# EAGLE schematic schematic_draft_v1 (EAGLE 9.6.2)
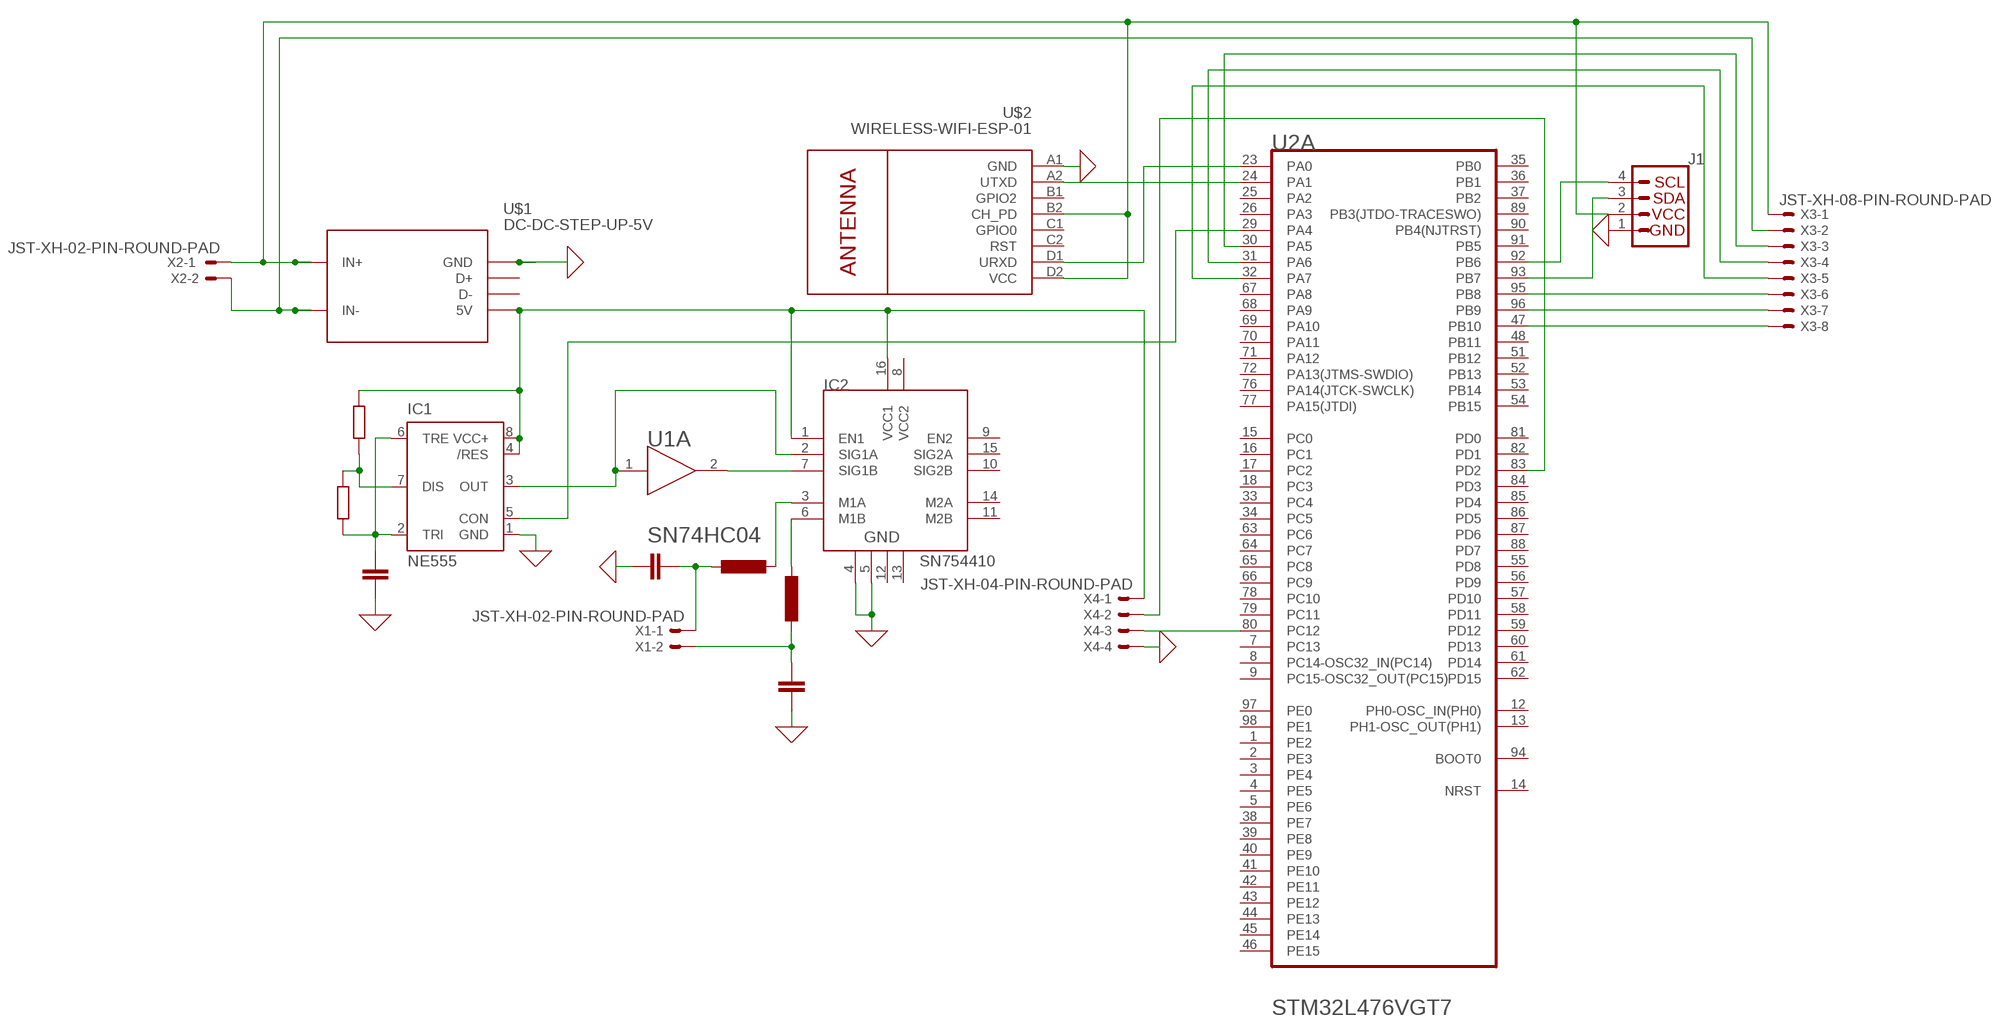
[diagram p0: schematic, sheet 1]

## Parts
IC1  NE555  [DIL-08]
IC2  SN754410  [DIP16]
J1  QWIIC_CONNECTORJS-1MM  [1X04_1MM_RA]
U1  TEXAS_INSTRUMENTS_SN74HC04TEXAS_INSTRUMENTS_SN74HC04_0_0  [TEXAS_INSTRUMENTS_SN74HC04_0]
U2  STMICROELECTRONICS_STM32L476VGT7STMICROELECTRONICS_STM32L476VGT7_0_0  [STMICROELECTRONICS_STM32L476VGT7_0]
U$1  DC-DC-STEP-UP-5V  [DC-DC-STEP-UP-5V]
U$2  WIRELESS-WIFI-ESP-01  [WIRELESS-WIFI-ESP-01]
X1  JST-XH-02-PIN-ROUND-PAD  [JST-XH-02-PACKAGE-ROUND-PAD]
X2  JST-XH-02-PIN-ROUND-PAD  [JST-XH-02-PACKAGE-ROUND-PAD]
X3  JST-XH-08-PIN-ROUND-PAD  [JST-XH-08-PACKAGE-ROUND-PAD]
X4  JST-XH-04-PIN-ROUND-PAD  [JST-XH-04-PACKAGE-ROUND-PAD]

## Nets
0: IC1.1(GND) IC2.4 IC2.5 J1.1(GND) U$1.GND U$2.A1(GND) X4.4 ; supply symbol labelled GND
N$1: U2.80(A:PC12) X4.3
N$2: J1.2(VCC) U$1.IN+ U$2.B2(CH_PD) U$2.D2(VCC) X2.1 X3.1
N$3: U$1.IN- X2.2 X3.2
N$4: IC1.2(TRI) IC1.6(TRE)
N$5: IC1.7(DIS)
N$6: J1.4(SCL) U2.92(A:PB6)
N$7: IC2.7(SIG1B) U1.2(A:!1Y!)
N$8: X1.1
N$9: X1.2
N$10: IC1.3(OUT) IC2.2(SIG1A) U1.1(A:1A)
N$11: U2.24(A:PA1) U$2.A2(UTXD)
N$12: IC2.3(M1A)
N$13: IC2.6(M1B)
N$14: U2.23(A:PA0) U$2.D1(URXD)
N$15: IC1.4(/RES) IC1.8(VCC+) IC2.1(EN1) IC2.16(VCC1) U$1.5V X4.1
N$16: J1.3(SDA) U2.93(A:PB7)
N$17: IC1.5(CON) U2.29(A:PA4)
N$18: U2.83(A:PD2) X4.2
N$24: U2.30(A:PA5) X3.3
N$25: U2.31(A:PA6) X3.4
N$26: U2.32(A:PA7) X3.5
N$27: U2.95(A:PB8) X3.6
N$28: U2.96(A:PB9) X3.7
N$29: U2.47(A:PB10) X3.8
Unconnected: IC2.9(EN2) IC2.10(SIG2B) IC2.11(M2B) IC2.14(M2A) IC2.15(SIG2A) U1.3(B:2A) U1.4(B:!2Y!) U1.5(C:3A) U1.6(C:!3Y!) U1.8(D:!4Y!) U1.9(D:4A) U1.10(E:!5Y!) U1.11(E:5A) U1.12(F:!6Y!) U1.13(F:6A) U2.1(A:PE2) U2.2(A:PE3) U2.3(A:PE4) U2.4(A:PE5) U2.5(A:PE6) U2.7(A:PC13) U2.8(A:PC14-OSC32_IN(PC14)) U2.9(A:PC15-OSC32_OUT(PC15)) U2.12(A:PH0-OSC_IN(PH0)) U2.13(A:PH1-OSC_OUT(PH1)) U2.14(A:NRST) U2.15(A:PC0) U2.16(A:PC1) U2.17(A:PC2) U2.18(A:PC3) U2.25(A:PA2) U2.26(A:PA3) U2.33(A:PC4) U2.34(A:PC5) U2.35(A:PB0) U2.36(A:PB1) U2.37(A:PB2) U2.38(A:PE7) U2.39(A:PE8) U2.40(A:PE9) U2.41(A:PE10) U2.42(A:PE11) U2.43(A:PE12) U2.44(A:PE13) U2.45(A:PE14) U2.46(A:PE15) U2.48(A:PB11) U2.51(A:PB12) U2.52(A:PB13) U2.53(A:PB14) U2.54(A:PB15) U2.55(A:PD8) U2.56(A:PD9) U2.57(A:PD10) U2.58(A:PD11) U2.59(A:PD12) U2.60(A:PD13) U2.61(A:PD14) U2.62(A:PD15) U2.63(A:PC6) U2.64(A:PC7) U2.65(A:PC8) U2.66(A:PC9) U2.67(A:PA8) U2.68(A:PA9) U2.69(A:PA10) U2.70(A:PA11) U2.71(A:PA12) U2.72(A:PA13(JTMS-SWDIO)) U2.76(A:PA14(JTCK-SWCLK)) U2.77(A:PA15(JTDI)) U2.78(A:PC10) U2.79(A:PC11) U2.81(A:PD0) U2.82(A:PD1) U2.84(A:PD3) U2.85(A:PD4) U2.86(A:PD5) U2.87(A:PD6) U2.88(A:PD7) U2.89(A:PB3(JTDO-TRACESWO)) U2.90(A:PB4(NJTRST)) U2.91(A:PB5) U2.94(A:BOOT0) U2.97(A:PE0) U2.98(A:PE1) U$1.D+ U$1.D- U$2.B1(GPIO2) U$2.C1(GPIO0) U$2.C2(RST)

## Power pins joined to a net without a drawn wire
1_VDD: U2.100(B:1_VDD)
1_VSS: U2.10(B:1_VSS)
2_VDD: U2.11(B:2_VDD)
2_VSS: U2.27(B:2_VSS)
3_VDD: U2.28(B:3_VDD)
3_VSS: U2.49(B:3_VSS)
4_VDD: U2.50(B:4_VDD)
4_VSS: U2.74(B:4_VSS)
5_VDD: U2.75(B:5_VDD)
5_VSS: U2.99(B:5_VSS)
GND: U1.7(G:GND)
P12: IC2.12
P13: IC2.13
VBAT: U2.6(B:VBAT)
VCC: U1.14(G:VCC)
VCC2: IC2.8(VCC2)
VDDA: U2.22(B:VDDA)
VDDUSB: U2.73(B:VDDUSB)
VREF+: U2.21(B:VREF+)
VREF-: U2.20(B:VREF-)
VSSA: U2.19(B:VSSA)

## Library data of the parts
IC1 = st-microelectronics:NE555: General purpose bipolar Timer; MF: Arrow Electronics; MPN: NE555N; OC_FARNELL: 1467742; OC_NEWARK: 89K1486
IC2 = HBridge:SN754410: Quadruple half-H driver
J1 = SparkFun-Connectors:QWIIC_CONNECTOR: SparkFun I2C Standard Qwiic Connector An SMD 1mm pitch JST connector makes it easy and quick (get it? Qwiic?) to connect I2C devices to each other. The Qwiic system <http://www.sparkfun.com/qwiic> enables fast and solderless connection between popular platforms and various sensors and actuators. We carry 200mm <https://www.sparkfun.com/products/14204>, 100mm <https://www.sparkfun.com/products/14205>, 50mm <https://www.sparkfun.com/products/14206>, and breadboard friendly <https://www.sparkfun.com/products/14207> Qwiic cables. We also offer 10 pcs strips <https://www.sparkfun.com/products/14323> the SMD connectors.
U1 = Texas Instruments - SN74HC04:TEXAS_INSTRUMENTS_SN74HC04: TI-CD_SNX4XXXXXX4X_19A-14; BITS: 6; CIIVA_IDS: 4052661; CODE__JEDEC: MS-001; DATASHEET_VERSION: SCLS078F; FOOTPRINT_VARIANT_NAME_0: Manufacturer Recommended; F__NOM_VOLTAGEMAXMHZ: 20; ICC__NOM_VOLTAGEMAXMA: 0.02; IMPORTED: yes; IMPORTED_FROM: vault; IMPORT_TS: 1521859069; INPUT_TYPE: CMOS; MF: Texas Instruments; MPN: SN74HC04; OPERATING_TEMPERATURE_RANGEC: -40 to 85; OUTPUT_DRIVE_IOLIOHMAXMA: -4/4; OUTPUT_TYPE: CMOS; PACKAGE: N0014A; PIN_0_0_1_OUTSIDE_EDGE: dot; PIN_0_1_1_OUTSIDE_EDGE: dot; PIN_0_2_1_OUTSIDE_EDGE: dot; PIN_0_3_0_OUTSIDE_EDGE: dot; PIN_0_4_0_OUTSIDE_EDGE: dot; PIN_0_5_0_OUTSIDE_EDGE: dot; PREFIX: U; RATING: Catalog; RELEASE_DATE: 1459315882; SCHMITT_TRIGGER: No; TECHNOLOGY_FAMILY: HC; TPD__NOM_VOLTAGEMAXNS: 20; VAULT_GUID: 1D4317D7-5FA1-43C1-8CD8-8C425FC0F157; VAULT_REVISION: 1ECE4C00-C8F4-4D9F-A418-E20F445A5193; VCC_MAX_V: 6; VCC_MIN_V: 2; VOLTAGE_NOM_V: 5
U2 = STMicroelectronics - STM32L476VGT7:STMICROELECTRONICS_STM32L476VGT7: MC-ARM-STM32L4X6-LQFP100; CIIVA_IDS: 21466698; COMPONENT_LINK_1_DESCRIPTION: Manufacturer URL; COMPONENT_LINK_1_URL: http://www.st.com/; CORE: ARM Cortex-M4; DATASHEET: http://www.st.com/st-web-ui/static/active/en/resource/technical/document/datasheet/DM00108832.pdf; DATASHEET_VERSION: Rev. 4; DA_CONVERTER: 2; FLASH_SIZE_PROG_KB: 1024; FOOTPRINT_VARIANT_NAME_0: Level C; FOOTPRINT_VARIANT_NAME_1: Level B; FOOTPRINT_VARIANT_NAME_2: Level A; IMPORTED: yes; IMPORTED_FROM: vault; IMPORT_TS: 1521857223; INTERNAL_RAM_SIZE_KB: 128; IOS_HIGH_CURRENT: 82; MF: STMicroelectronics; MOUNTING_TECHNOLOGY: Surface Mount; MPN: STM32L476VGT7; OPERATING_FREQUENCYF_PROCESSOR_SPEED_MHZ: 80; PACKAGE_DESCRIPTION: 100-Pin Low Profile Quad Flat Package, Body 14 x 14 mm, Pitch 0.5 mm; PACKAGE_REFERENCE: LQFP100; PACKING: Tray; PREFIX: U; RELEASE_DATE: 1490165194; SUPPLY_VOLTAGEVCC_MIN_V: 1.71; VAULT_GUID: CDBC164E-B4B4-4E4D-B83F-D50706222325; VAULT_REVISION: 7B18CC43-6F38-4D69-81AA-173698F48D2A
U$1 = diy-modules:DC-DC-STEP-UP-5V: DC/DC Step-Up Converter
U$2 = diy-modules:WIRELESS-WIFI-ESP-01: Wireless Wi-Fi ESP-01 Module based on ESP8266 chip Click here to find device on ebay.com <http://www.ebay.com/sch/esp8266+esp+01+transceiver>
X1 X2 = Rembrandt Electronics - JST XH Connectors v1-0:JST-XH-02-PIN: JST XH Connector 2 Pin Wire to board connector. Pitch: 2,54 mm, (0.100") Number of pins: 2 Created by Rembrandt Electronics www.rembrandtelectronics.com
X3 = Rembrandt Electronics - JST XH Connectors v1-0:JST-XH-08-PIN: JST XH Connector 2 Pin Wire to board connector. Pitch: 2,54 mm, (0.100") Number of pins: 8 Created by Rembrandt Electronics www.rembrandtelectronics.com
X4 = Rembrandt Electronics - JST XH Connectors v1-0:JST-XH-04-PIN: JST XH Connector 2 Pin Wire to board connector. Pitch: 2,54 mm, (0.100") Number of pins: 4 Created by Rembrandt Electronics www.rembrandtelectronics.com